# EAGLE design ll3-b2 (EAGLE 5.10)
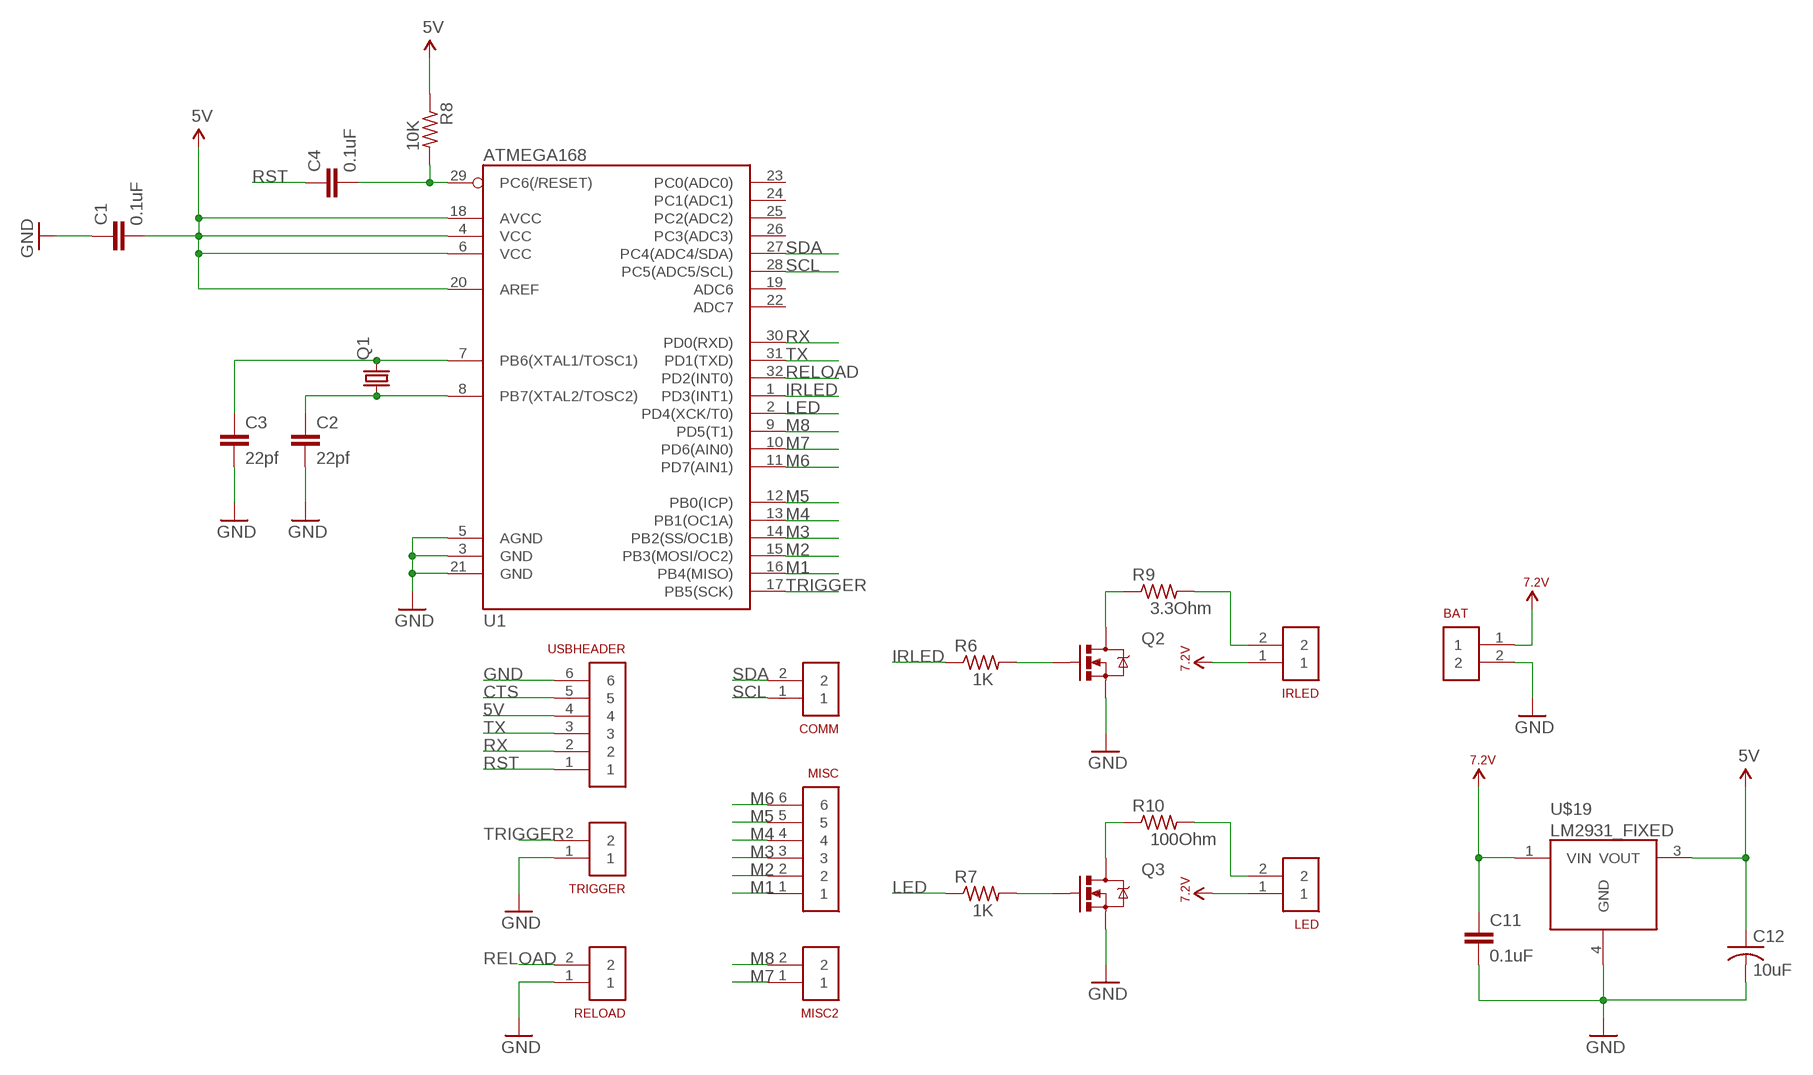
[diagram p0: schematic, sheet 1]

## Parts
BAT  2HEAD  [2HEAD]
C1  0.1uF  CAP0603-CAP  [0603-CAP]
C2  22pf  CAP0603-CAP  [0603-CAP]
C3  22pf  CAP0603-CAP  [0603-CAP]
C4  0.1uF  CAP0603-CAP  [0603-CAP]
C11  0.1uF  CAP0603-CAP  [0603-CAP]
C12  10uF  C-USC0603  [C0603]
COMM  2HEAD  [2HEAD]
IRLED  2HEAD  [2HEAD]
LED  2HEAD  [2HEAD]
MISC  6HEAD  [6HEAD]
MISC2  2HEAD  [2HEAD]
Q1  CRYSTAL5X3  [CRYSTAL-SMD-5X3]
Q2  MOSFET-NCHANNELSMD  [SOT23-3]
Q3  MOSFET-NCHANNELSMD  [SOT23-3]
R6  1K  R-US_R0603  [R0603]
R7  1K  R-US_R0603  [R0603]
R8  10K  R-US_R0603  [R0603]
R9  3.3Ohm  R-US_R0603  [R0603]
R10  100Ohm  R-US_R0603  [R0603]
RELOAD  2HEAD  [2HEAD]
TRIGGER  2HEAD  [2HEAD]
U1  ATMEGA168  [TQFP32-08]
U$19  LM2931_FIXED  [DPAK]
USBHEADER  6HEAD  [6HEAD]

## Nets
5V: C1.2 C12.1 R8.1 U1.4(VCC) U1.6(VCC) U1.18(AVCC) U1.20(AREF) U$19.3(VOUT) USBHEADER.4
7.2V: BAT.1 C11.1 IRLED.1 LED.1 U$19.1(VIN)
CTS: USBHEADER.5
GND: BAT.2 C1.1 C2.2 C3.2 C11.2 C12.2 Q2.2(S) Q3.2(S) RELOAD.1 TRIGGER.1 U1.3(GND) U1.5(AGND) U1.21(GND) U$19.4(GND) USBHEADER.6
IRLED: R6.1 U1.1(PD3(INT1))
LED: R7.1 U1.2(PD4(XCK/T0))
M1: MISC.1 U1.16(PB4(MISO))
M2: MISC.2 U1.15(PB3(MOSI/OC2))
M3: MISC.3 U1.14(PB2(SS/OC1B))
M4: MISC.4 U1.13(PB1(OC1A))
M5: MISC.5 U1.12(PB0(ICP))
M6: MISC.6 U1.11(PD7(AIN1))
M7: MISC2.1 U1.10(PD6(AIN0))
M8: MISC2.2 U1.9(PD5(T1))
N$1: C2.1 Q1.1 U1.8(PB7(XTAL2/TOSC2))
N$2: C3.1 Q1.3 U1.7(PB6(XTAL1/TOSC1))
N$3: C4.2 R8.2 U1.29(PC6(/RESET))
N$14: Q2.1(G) R6.2
N$15: Q3.1(G) R7.2
N$16: IRLED.2 R9.2
N$17: LED.2 R10.2
N$18: Q3.3(D) R10.1
N$20: Q2.3(D) R9.1
RELOAD: RELOAD.2 U1.32(PD2(INT0))
RST: C4.1 USBHEADER.1
RX: U1.30(PD0(RXD)) USBHEADER.2
SCL: COMM.1 U1.28(PC5(ADC5/SCL))
SDA: COMM.2 U1.27(PC4(ADC4/SDA))
TRIGGER: TRIGGER.2 U1.17(PB5(SCK))
TX: U1.31(PD1(TXD)) USBHEADER.3
Unconnected: U1.19(ADC6) U1.22(ADC7) U1.23(PC0(ADC0)) U1.24(PC1(ADC1)) U1.25(PC2(ADC2)) U1.26(PC3(ADC3))

## Library data of the parts
BAT COMM IRLED LED MISC2 RELOAD TRIGGER = custom:2HEAD
C1-C4 C11 = sparkfun:CAP: Capacitor Standard 0603 ceramic capacitor, and 0.1" leaded capacitor.
C12 = rcl:C-US: CAPACITOR, American symbol
MISC USBHEADER = custom:6HEAD
Q1 = sparkfun:CRYSTAL: Crystals Various standard crystals. Proven footprints. Spark Fun Electronics SKU : COM-00534
Q2 Q3 = sparkfun:MOSFET-NCHANNEL
R6-R10 = rcl:R-US_: RESISTOR, American symbol
U1 = sparkfun:ATMEGA168
U$19 = sparkfun:LM2931_FIXED

## Board
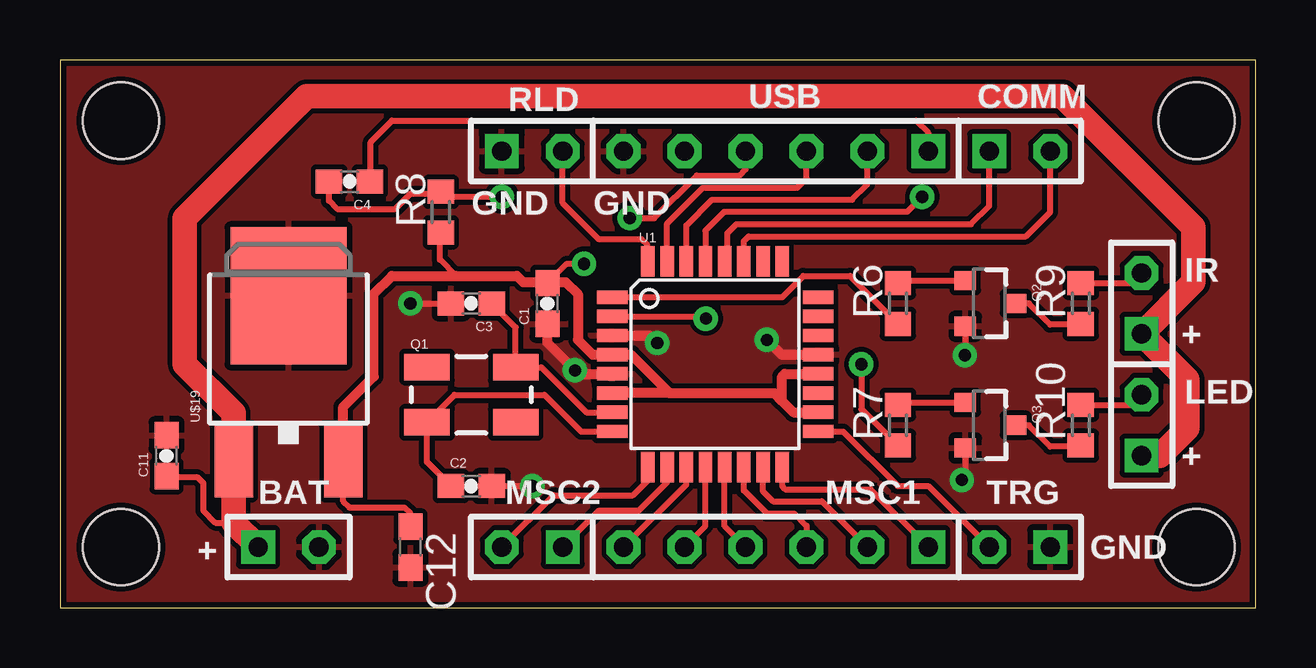
[diagram p1: board, top side]
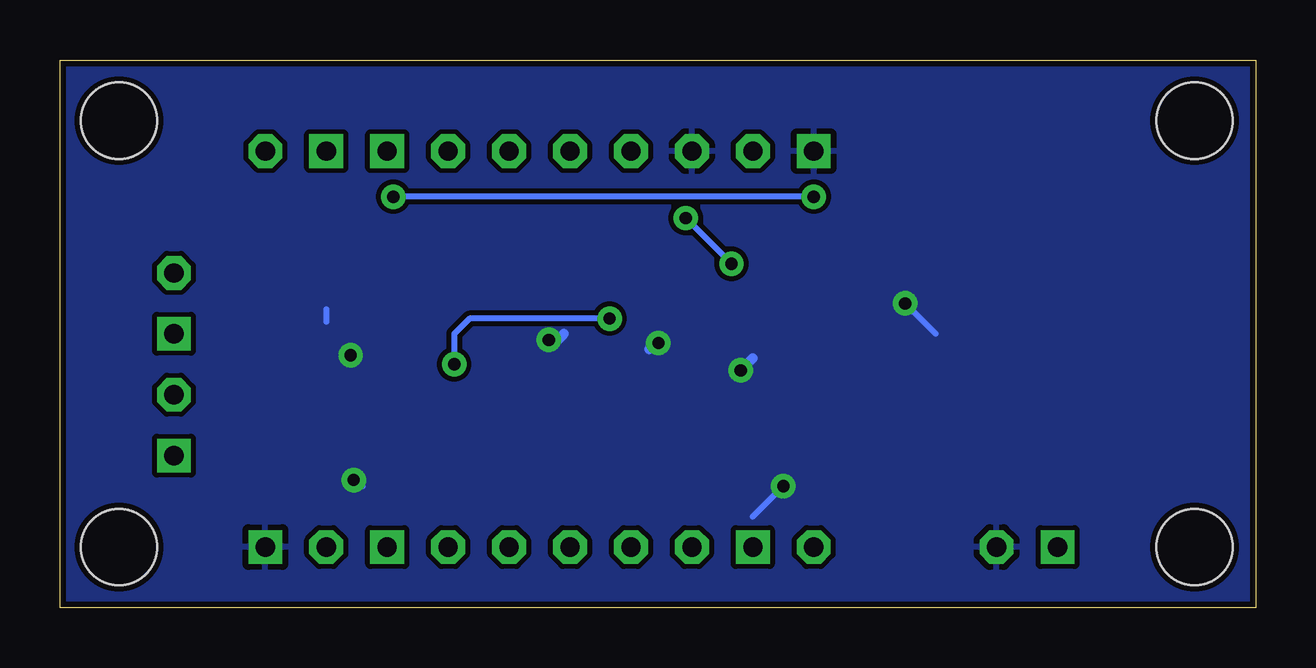
[diagram p2: board, bottom side, seen from below]

Size 49.84 x 22.85 mm. Coordinates in mm from the lower left corner, seen from the top.
Outline: 0,0 49.84,0 49.84,22.85 0,22.85 0,0
Copper layers (1*16): Top 0.035mm / dielectric 1.5mm / Bottom 0.035mm
Design rules "SparkFun": minimum track width 8mil, minimum drill 20mil, track to track 8mil, track to pad 8mil, pad to pad 8mil, via to via 8mil, smd to smd 8mil, copper to edge 10mil, drill to drill 8mil, minimum pad ring 12mil, minimum via ring 10mil, stop-mask expansion 4mil, vias tented up to drill 25mil, thermal gap 10mil
Holes 3.17 mm at 2.54,20.32 2.54,2.54 47.37,2.54 47.37,20.32

### Footprints (pad centres in the part's own frame; a part is rotated, then mirrored left to right if it is on the bottom)
2HEAD = drill 0.8 square: 1 -1.27,0 | drill 0.8 octagon: 2 1.27,0
0603-CAP = smd 1.1 x 1: 1 -0.85,0; 2 0.85,0
C0603 = smd 1.1 x 1: 1 -0.85,0; 2 0.85,0
6HEAD = drill 0.8 square: 1 -6.35,0 | drill 0.8 octagon: 2 -3.81,0; 3 -1.27,0; 4 1.27,0; 5 3.81,0; 6 6.35,0
CRYSTAL-SMD-5X3 = smd 1.9 x 1.1: 1 -1.85,-1.15; 2 1.85,-1.15; 3 1.85,1.15; 4 -1.85,1.15
SOT23-3 = smd 0.8 x 0.9: 1 -0.95,-1; 2 0.95,-1; 3 0,1.1
R0603 = smd 1 x 1.1: 1 -0.85,0; 2 0.85,0
TQFP32-08 = smd 1.27 x 0.559: 1 -4.293,2.8; 2 -4.293,2; 3 -4.293,1.2; 4 -4.293,0.4; 5 -4.293,-0.4; 6 -4.293,-1.2; 7 -4.293,-2; 8 -4.293,-2.8; 17 4.293,-2.8; 18 4.293,-2; 19 4.293,-1.2; 20 4.293,-0.4; 21 4.293,0.4; 22 4.293,1.2; 23 4.293,2; 24 4.293,2.8 | smd 0.559 x 1.27: 9 -2.8,-4.293; 10 -2,-4.293; 11 -1.2,-4.293; 12 -0.4,-4.293; 13 0.4,-4.293; 14 1.2,-4.293; 15 2,-4.293; 16 2.8,-4.293; 25 2.8,4.293; 26 2,4.293; 27 1.2,4.293; 28 0.4,4.293; 29 -0.4,4.293; 30 -1.2,4.293; 31 -2,4.293; 32 -2.8,4.293
DPAK = smd 1.6 x 3: 1 -2.28,-5.31; 3 2.28,-5.31 | smd 4.826 x 5.715: 4 0,1.588

### Placement (x,y rotation side)
BAT  9.53,2.54 0 top
C1  20.32,12.7 90 top
C2  17.14,5.08 0 top
C3  17.14,12.7 180 top
C4  12.06,17.78 180 top
C11  4.45,6.35 90 top
C12  14.61,2.54 270 top
COMM  40.01,19.05 0 top
IRLED  45.09,12.7 90 top
LED  45.09,7.62 90 top
MISC  29.84,2.54 180 top
MISC2  19.68,2.54 180 top
Q1  17.14,8.89 0 top
Q2  38.73,12.7 270 top
Q3  38.73,7.62 270 top
R6  34.92,12.7 90 top
R7  34.92,7.62 90 top
R8  15.88,16.51 90 top
R9  42.55,12.7 90 top
R10  42.55,7.62 90 top
RELOAD  19.68,19.05 0 top
TRIGGER  40.01,2.54 180 top
U1  27.3,10.16 0 top
U$19  9.53,11.43 0 top
USBHEADER  29.84,19.05 180 top

### Tracks (layer width: path | path; a pad name or v marks a point on that pad's centre or on a via)
5V  (via drill 0.51)
  Top 0.254: R8.1 16.17,15.66 | USBHEADER.4 28.57,18.29 28.32,18.03 26.54,18.03 24.77,16.26 v23.75,16.26 | v21.84,14.35 21.12,14.35 C1.2 | 15.84,15.62 15.84,14.52 16.51,13.84 | U$19.3 11.81,4.45 12.06,4.19 14.35,4.19 14.61,3.94 C12.1
  Top 0.406: U1.18 30.57,8.16 30.1,8.64 | U1.20 30.21,9.76 30.1,9.65 30.1,8.64 | 25.4,8.96 U1.6 | 25.4,8.96 29.77,8.96 30.1,8.64 | 25.4,8.96 23.8,10.56 U1.4 22.21,10.56 21.59,11.18 21.59,13.08 21.08,13.59 20.36,13.59 | 15.84,15.62 R8.1 | 20.36,13.59 C1.2 | 20.36,13.59 19.3,13.59 19.05,13.84 16.51,13.84 13.84,13.84 13.08,13.08 13.08,9.65 11.81,8.38 U$19.3
  Bottom 0.254: v21.84,14.35 v23.75,16.26
7.2V
  Top 0.254: 7.24,3.56 6.48,3.56 5.97,4.06 5.97,5.21 5.71,5.46 4.48,5.46 C11.1
  Top 1.016: LED.1 45.85,6.35 46.99,7.49 46.99,9.53 IRLED.1 47.24,13.59 47.24,15.88 41.78,21.34 10.29,21.34 5.21,16.26 5.21,10.16 7.24,8.13 7.24,3.56 BAT.1 7.25,3.55 U$19.1
GND  (via drill 0.51)
  Top 0.254: C2.2 v19.68,5.08 | v14.61,12.7 C3.2 | Q2.2 37.73,10.56 v37.72,10.54 | Q3.2 37.73,5.48 v37.59,5.33
  Top 0.406: U1.21 30.08,10.56 v29.46,11.18 | U1.5 21.61,9.76 v21.46,9.91 20.32,11.05 C1.1 | U1.3 24.58,11.36 v24.89,11.05
  Bottom 0.254: v19.68,5.08 20.95,3.81 | 13.34,11.43 v14.61,12.7 | 38.73,12.45 38.73,11.94 | v37.72,10.54 37.97,10.29 | v37.59,5.33 37.47,5.33 37.21,5.08
  Bottom 0.406: v29.46,11.18 29.08,11.18 28.83,11.43 | v21.46,9.91 20.95,10.41 | v24.89,11.05 25.02,11.05 25.27,10.79
  pour Bottom: 0,22.86 50.16,22.86 50.16,0 0,0
  pour Top: 0,22.86 50.16,22.86 50.16,0 0,0
IRLED
  Top 0.254: U1.1 30.11,12.96 30.99,13.84 32.93,13.84 R6.1
LED  (via drill 0.51)
  Top 0.254: v33.4,10.16 33.4,8.29 R7.1 | U1.2 26.83,12.16 v26.92,12.06
  Bottom 0.254: v26.92,12.06 32.77,12.06 33.4,11.43 v33.4,10.16
M1
  Top 0.254: U1.16 30.11,5.07 30.23,4.95 33.78,4.95 MISC.1
M2
  Top 0.254: U1.15 29.3,4.86 29.72,4.45 31.75,4.45 MISC.2
M3
  Top 0.254: U1.14 28.5,4.9 29.46,3.94 30.61,3.94 31.11,3.43 MISC.3
M4
  Top 0.254: U1.13 27.7,3.41 MISC.4
M5
  Top 0.254: U1.12 26.91,3.41 MISC.5
M6
  Top 0.254: U1.11 26.11,5.15 MISC.6
M7
  Top 0.254: U1.10 25.3,5.24 24.13,4.06 22.48,4.06 MISC2.1
M8
  Top 0.254: U1.9 24.5,5.33 23.88,4.7 20.57,4.7 MISC2.2
N$1
  Top 0.254: C2.1 15.29,6.08 Q1.1 16.45,8.89 20.19,8.89 21.72,7.36 U1.8
N$2
  Top 0.254: Q1.3 19.11,10.16 | Q1.3 19,11.7 C3.1 | U1.7 21.94,8.16 20.07,10.03 Q1.3
N$3  (via drill 0.51)
  Top 0.254: U1.29 26.91,15.73 27.69,16.51 35.31,16.51 v35.94,17.14 | v18.41,17.14 16.09,17.14 R8.2 | R8.2 15.84,17.4 | C4.2 11.21,16.98 11.56,16.64 13.97,16.64 14.61,17.27 15.79,17.27 R8.2
  Bottom 0.254: v18.41,17.14 v35.94,17.14
N$14
  Top 0.254: Q2.1 35.02,13.65 R6.2
N$15
  Top 0.254: Q3.1 35.02,8.57 R7.2
N$16
  Top 0.254: R9.2 44.66,13.55 IRLED.2
N$17
  Top 0.254: R10.2 44.66,8.47 LED.2
N$18
  Top 0.254: Q3.3 40.39,7.62 41.27,6.73 42.51,6.73 R10.1
N$20
  Top 0.254: Q2.3 40.39,12.7 41.27,11.81 42.51,11.81 R9.1
RELOAD
  Top 0.254: U1.32 24.48,14.48 24.48,15.14 24.26,15.37 22.48,15.37 20.95,16.89 RELOAD.2
RST
  Top 0.254: USBHEADER.1 36.2,19.81 35.69,20.32 13.84,20.32 12.95,19.43 12.95,17.82 C4.1
RX
  Top 0.254: 26.04,14.52 U1.30 26.11,15.95 27.18,17.02 33.02,17.02 33.66,17.65 USBHEADER.2
SCL
  Top 0.254: U1.28 27.81,14.56 27.81,15.62 28.19,16 37.97,16 38.73,16.76 COMM.1
SDA
  Top 0.254: U1.27 28.5,15.3 28.7,15.49 40.26,15.49 41.27,16.51 COMM.2
TRIGGER
  Top 0.254: U1.17 32.65,7.36 34.92,5.08 36.2,5.08 TRIGGER.2
TX
  Top 0.254: USBHEADER.3 31.11,17.91 30.73,17.53 26.8,17.53 25.3,16.03 U1.31

### Text on the board
tPlace: RLD | USB | COMM | GND | GND | IR | + | LED | + | BAT | MSC2 | MSC1 | TRG | + | GND